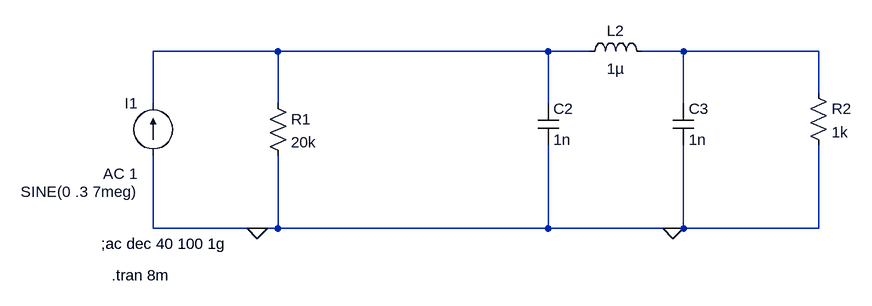
[diagram p0: schematic colpits-small signal.asc]
colpits-small signal.asc, the LTspice schematic file:
Version 4
SHEET 1 1360 680
WIRE 160 16 -32 16
WIRE 576 16 160 16
WIRE 640 16 576 16
WIRE 784 16 720 16
WIRE 992 16 784 16
WIRE 992 80 992 16
WIRE -32 96 -32 16
WIRE 160 96 160 16
WIRE 576 96 576 16
WIRE 784 96 784 16
WIRE -32 288 -32 176
WIRE 128 288 -32 288
WIRE 160 288 160 176
WIRE 160 288 128 288
WIRE 576 288 576 160
WIRE 576 288 160 288
WIRE 768 288 576 288
WIRE 784 288 784 160
WIRE 784 288 768 288
WIRE 992 288 992 160
WIRE 992 288 784 288
FLAG 128 288 0
FLAG 768 288 0
SYMBOL res 144 80 R0
SYMATTR InstName R1
SYMATTR Value 20k
SYMBOL current -32 176 R180
WINDOW 0 24 80 Left 2
WINDOW 3 24 -56 Left 2
WINDOW 123 24 -28 Left 2
WINDOW 39 0 0 Left 0
SYMATTR InstName I1
SYMATTR Value SINE(0 .3 7meg)
SYMATTR Value2 AC 1
SYMBOL cap 560 96 R0
SYMATTR InstName C2
SYMATTR Value 1n
SYMBOL cap 768 96 R0
SYMATTR InstName C3
SYMATTR Value 1n
SYMBOL ind 624 32 R270
WINDOW 0 32 56 VTop 2
WINDOW 3 5 56 VBottom 2
SYMATTR InstName L2
SYMATTR Value 1µ
SYMBOL res 976 64 R0
SYMATTR InstName R2
SYMATTR Value 1k
TEXT -112 312 Left 2 !;ac dec 40 100 1g
TEXT -96 360 Left 2 !.tran 8m

The netlist it stands for:
* colpits-small signal.asc
R1 N001 0 20k
I1 0 N001 SINE(0 .3 7meg) AC 1
C2 N001 0 1n
C3 N002 0 1n
L2 N001 N002 1µ
R2 N002 0 1k
;ac dec 40 100 1g
.tran 8m
.backanno
.end